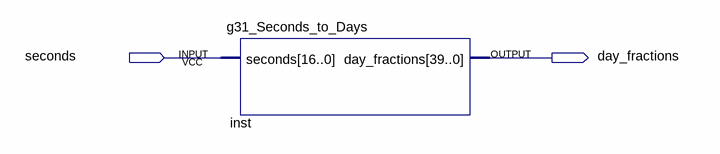
[diagram p0: schematic sheet]
// Quartus schematic g31_Seconds_to_Days_Circuit.bdf as structural Verilog: 1 symbols, 2 pins
module g31_Seconds_to_Days_Circuit (
  input  seconds,
  output day_fractions
);

  g31_Seconds_to_Days inst (.seconds({17{seconds}}), .day_fractions(day_fractions));
endmodule
